# EAGLE design EC_mini_v31 (EAGLE 7.6.0)
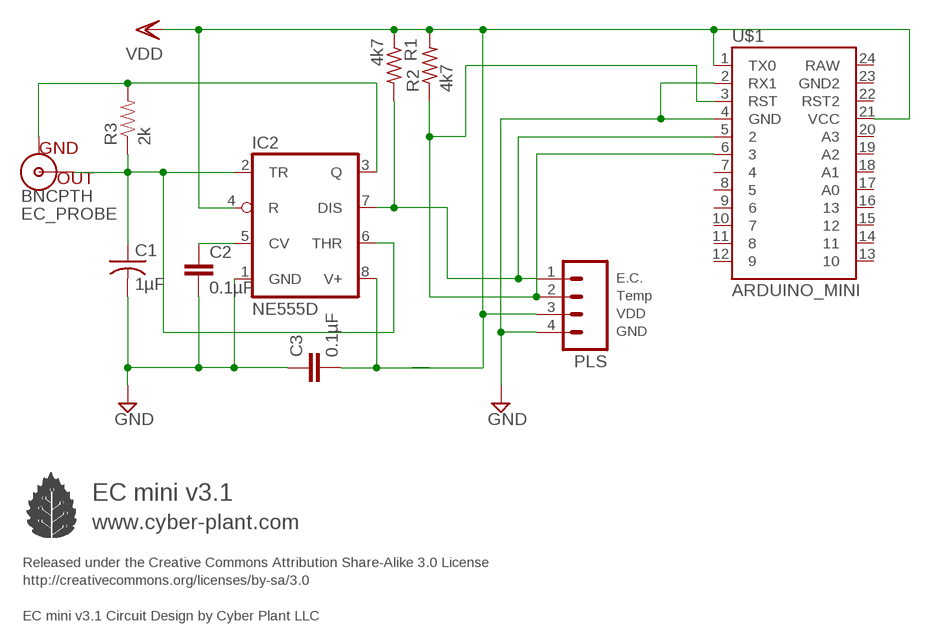
[diagram p0: schematic, sheet 1]

## Parts
C1  1µF  C-US050-045X075  [C050-045X075]
C2  0.1µF  CAP1206  [1206]
C3  0.1µF  CAP1206  [1206]
EC_PROBE  BNCPTH  [BNC]
IC2  NE555D  [SO08]
PLS  M04PTH  [1X04]
R1  4k7  R-US_0207/10  [0207/10]
R2  4k7  R-US_0207/10  [0207/10]
R3  2k  RESISTOR1206  [1206]
U$1  ARDUINO_MINI  [ARDUINO_MINI]

## Nets
GND: C1.2 C2.2 C3.1 IC2.1(GND) PLS.4 U$1.2(RX1) U$1.4(GND)
N$1: PLS.2 R2.1 U$1.3(RST) U$1.6
N$16: IC2.7(DIS) PLS.1 R1.2 U$1.5
N$21: C1.1 EC_PROBE.S(OUT) IC2.2(TR) IC2.6(THR) R3.1
N$23: EC_PROBE.GND IC2.3(Q) R3.2
N$26: C2.1 IC2.5(CV)
VDD: C3.2 IC2.4(R) IC2.8(V+) PLS.3 R1.1 R2.2 U$1.1(TX0) U$1.21(VCC)
Unconnected: U$1.7 U$1.8 U$1.9 U$1.10 U$1.11 U$1.12 U$1.13 U$1.14 U$1.15 U$1.16 U$1.17(A0) U$1.18(A1) U$1.19(A2) U$1.20(A3) U$1.22(RST2) U$1.23(GND2) U$1.24(RAW)

## Notes on the sheet
- E.C.
- Temp
- VDD
- GND
- EC mini v3.1
- www.cyber-plant.com
- Released under the Creative Commons Attribution Share-Alike 3.0 License
- http://creativecommons.org/licenses/by-sa/3.0
- EC mini v3.1 Circuit Design by Cyber Plant LLC

## Library data of the parts
C1 = adafruit:C-US: CAPACITOR, American symbol
C2 C3 = SparkFun:CAP: Capacitor Standard 0603 ceramic capacitor, and 0.1" leaded capacitor.
EC_PROBE = BNCnoContur:BNC: BNC Connector, Mouser Part# 5227161
IC2 = adafruit:*555: TIMER Changed DIP package to have round (not oval) pin pads http://www.ladyada.net/library/pcb/eaglelibrary.html
PLS = Arduinominimi:M04: Header 4 Standard 4-pin 0.1" header. Use with straight break away headers (SKU : PRT-00116), right angle break away headers (PRT-00553), swiss pins (PRT-00743), machine pins (PRT-00117), and female headers (PRT-00115). Molex polarized connector foot print use with SKU : PRT-08231 with associated crimp pins and housings. 1MM SMD Version SKU: PRT-10208
R1 R2 = resistor:R-US_: RESISTOR, American symbol
R3 = SparkFun:RESISTOR: Resistor Basic schematic elements and footprints for 0603, 1206, and PTH resistors.; PROD_ID: RES-00824
U$1 = Arduinominimi:ARDUINO_MINI

## Board
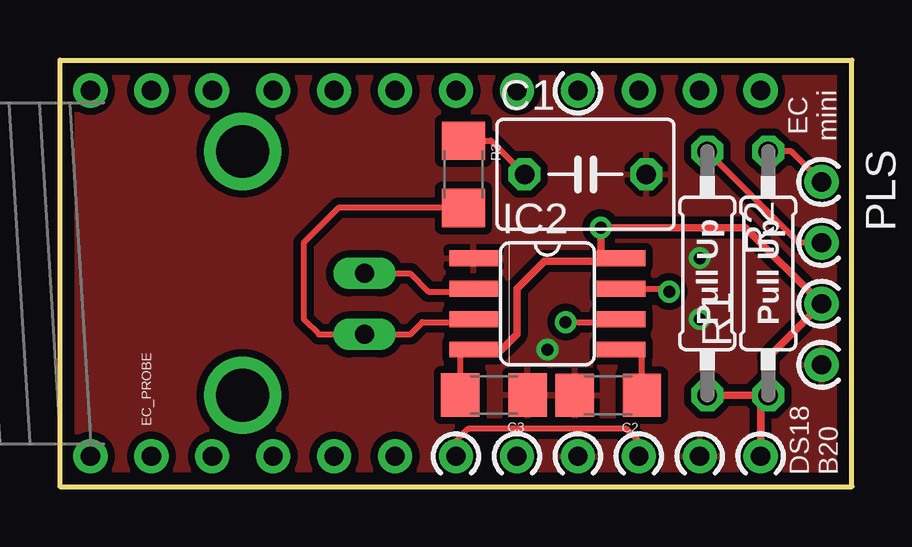
[diagram p1: board, top side]
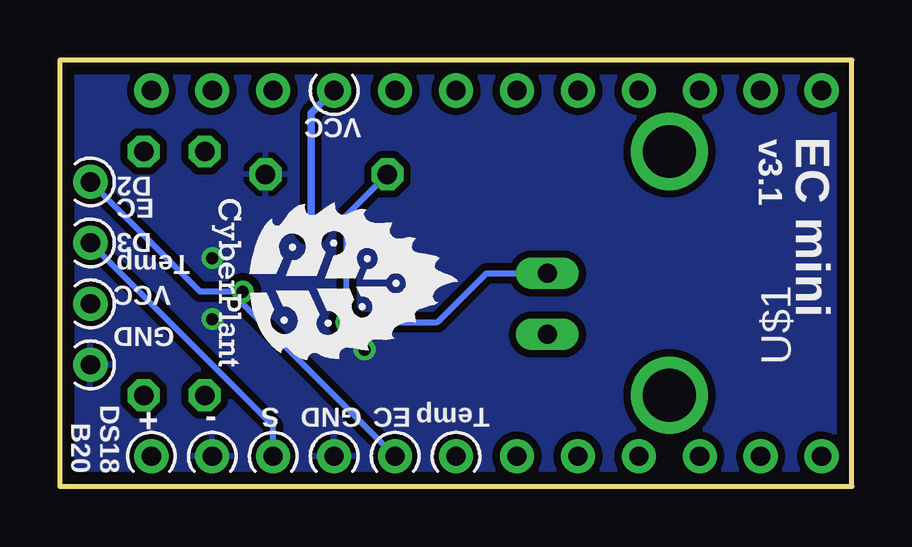
[diagram p2: board, bottom side, seen from below]

Size 33.02 x 17.78 mm. Coordinates in mm from the lower left corner, seen from the top.
Outline: 33.02,0 33.02,17.78 0,17.78 0,0 33.02,0
Copper layers (1*16): Top 0.035mm / dielectric 1.5mm / Bottom 0.035mm
Design rules "default *": minimum track width 10mil, minimum drill 12mil, track to track 10mil, track to pad 10mil, pad to pad 10mil, via to via 10mil, smd to smd 10mil, copper to edge 0.5mm, drill to drill 12mil, minimum pad ring 10mil, minimum via ring 8mil, stop-mask expansion 4mil, vias tented up to drill 20mil, thermal gap 10mil

### Footprints (pad centres in the part's own frame; a part is rotated, then mirrored left to right if it is on the bottom)
C050-045X075 = drill 0.813 octagon: 1 -2.54,0; 2 2.54,0
1206 = smd 1.6 x 1.8: 1 -1.4,0; 2 1.4,0
BNC = drill 2.2: 3 -5.08,5.08; 4 5.08,5.08 | drill 0.8 long: GND -2.54,0; S 0,0
SO08 = smd 0.66 x 2.032: 1 -1.905,-3.073; 2 -0.635,-3.073; 3 0.635,-3.073; 4 1.905,-3.073; 5 1.905,3.073; 6 0.635,3.073; 7 -0.635,3.073; 8 -1.905,3.073
1X04 = drill 0.8 pad 1.422: 1 0,0; 2 2.54,0; 3 5.08,0; 4 7.62,0
0207/10 = drill 0.813 octagon: 1 -5.08,0; 2 5.08,0
ARDUINO_MINI = drill 0.8 pad 1.422: 1 -7.62,12.7; 2 -7.62,10.16; 3 -7.62,7.62; 4 -7.62,5.08; 5 -7.62,2.54; 6 -7.62,0; 7 -7.62,-2.54; 8 -7.62,-5.08; 9 -7.62,-7.62; 10 -7.62,-10.16; 11 -7.62,-12.7; 12 -7.62,-15.24; 13 7.62,-15.24; 14 7.62,-12.7; 15 7.62,-10.16; 16 7.62,-7.62; 17 7.62,-5.08; 18 7.62,-2.54; 19 7.62,0; 20 7.62,2.54; 21 7.62,5.08; 22 7.62,7.62; 23 7.62,10.16; 24 7.62,12.7

### Placement (x,y rotation side)
C1  21.91,13.02 0 top
C2  22.86,3.81 180 top
C3  18.09,3.82 180 top
EC_PROBE  12.7,8.89 90 top
IC2  20.32,7.62 270 top
PLS  31.75,12.7 270 top
R1  29.53,8.89 90 top
R2  26.99,8.89 270 top
R3  16.83,13.02 270 top
U$1  16.51,8.89 90 bottom

### Tracks (layer width: path | path; a pad name or v marks a point on that pad's centre or on a via)
GND  (via drill 0.5)
  other vias: 26.67,9.53 26.67,6.99 20.32,5.71
  pour Top (isolate 0.305): 0,17.78 0,0 33.02,0 33.02,17.78
  pour Bottom (isolate 0.305): 0,0.64 0,17.14 33.02,17.14 33.02,0.64
N$1
  Top 0.254: U$1.6 16.51,1.91 17.02,2.41 23.62,2.41 24.13,1.91 U$1.3 | R2.1 30.8,10.16 PLS.2
  Bottom 0.254: U$1.3 24.13,2.54 PLS.2
N$16  (via drill 0.5)
  Top 0.254: PLS.1 30.48,13.97 R1.2 | IC2.7 25.27,8.26 v25.4,8.13
  Bottom 0.254: U$1.5 25.4,7.62 v25.4,8.13 27.18,8.13 PLS.1
N$21  (via drill 0.5)
  Top 0.254: EC_PROBE.S 14.61,8.89 15.37,8.13 17.12,8.13 IC2.2 | R3.1 17.97,14.42 C1.1 | v21.08,6.86 23.27,6.86 IC2.6
  Bottom 0.254: EC_PROBE.S 15.24,8.89 17.27,6.86 v21.08,6.86 21.08,11.3 C1.1
N$23
  Top 0.254: R3.2 11.62,11.62 10.16,10.16 10.16,6.99 10.8,6.35 EC_PROBE.GND 14.61,6.35 15.11,6.86 17.12,6.86 IC2.3
N$26
  Top 0.254: C2.1 24.26,5.58 24.13,5.71 IC2.5
VDD  (via drill 0.5)
  Top 0.254: 22.54,9.4 23.27,9.4 IC2.8 | C3.2 16.69,5.53 16.51,5.71 IC2.4
  Top 0.305: IC2.4 18.41,5.71 19.05,6.35 19.05,8.26 20.19,9.4 22.54,9.4 v22.54,10.79 28.58,10.79 PLS.3 29.53,5.4 R1.1 | IC2.4 | R1.1 R2.2 | U$1.1 29.21,3.49 R1.1 | 17.12,5.58 IC2.4
  Bottom 0.305: v22.54,10.79 22.54,15.56 U$1.21

### Text on the board
tPlace: EC / mini | Pull Up | Pull Up | DS18 / B20
bPlace: VCC | v3.1 | EC / D2 | EC mini | Temp / D3 | VCC | GND | Temp | EC | GND | S | - | + | DS18 / B20
_tsilk: JP5 | JP4 | GND | CN3 | Pump 2 | Pump 1 | TX | RX | BLA / BLK | CN2 | Enable | 16 | D9 / D8 | ISP | CN1 | 1X4-BIG | 10k | R6 | FDS6630A | Q2 | D7 / D6 | 1X4-BIG | Disable | N/A | SCLK / SCK | SDO / MISO | SDI / MOSI | CSB / SS | 1X4-BIG | 1M | LCD Module | R7 | N/A | FDS6630A | Q1 | D5 / GND | 100R for Pt100 | 1K for Pt1000 | 10k | R8 | D4 / GND | R1 | R9 | D1 | D7 | 5V / GND | 1 | 1M | MBRA140 | MBRA140 | JP2 | 10k | CyberPlant | R11 | Pump 1 | RTD2 | pH Corrector Shield v3.0 | FSMCD | S3 | GND | IC1 | 4.3K | R5 | 10k | Vin | LMP2 | R4 | 1.3K | LMP91200_PW_16 | R10 | FSMCD | GND | CN6 | 680R | R3 | 2K | R2 | S1 | S4 | CN5 | 5V | FSMCD | Vin | J1 | GND | CN4 | Pump 2 | BNC | Analog | A1 | A2 | A3 | JP1 | 5V | GND | VIN | JP3 | SDA | SCL | S2 | FSMCD | BNC2